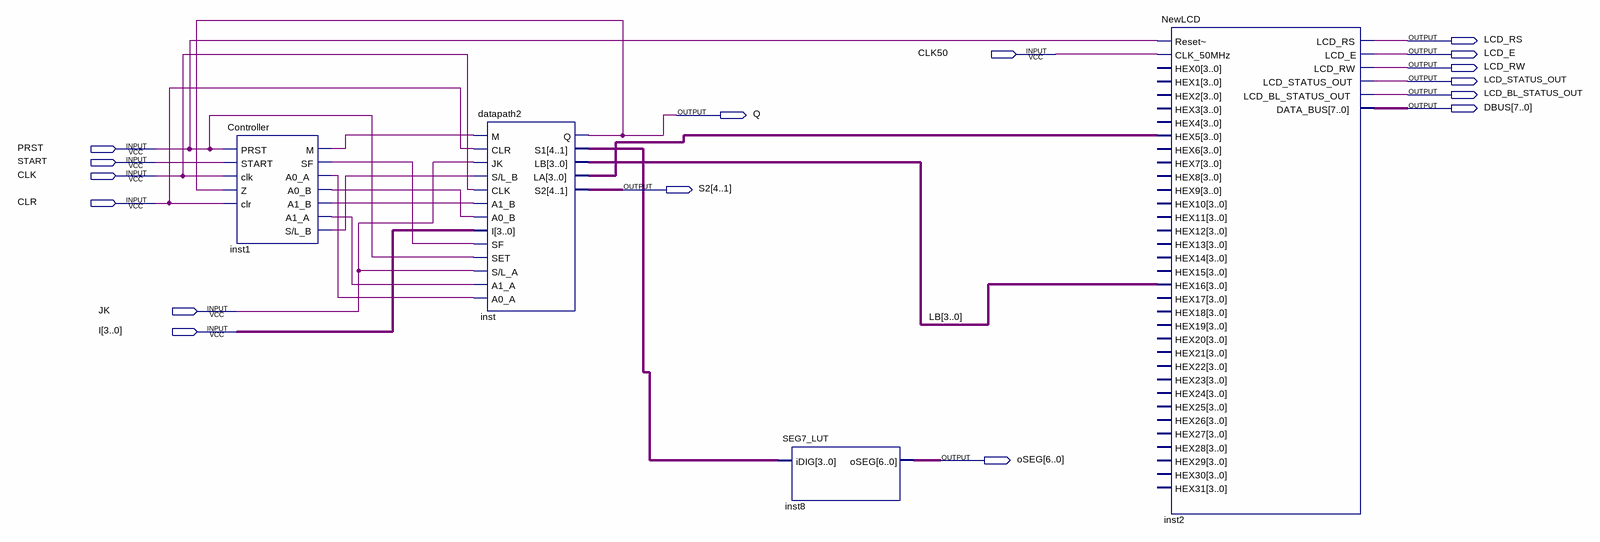
[diagram p0: schematic sheet]
// Quartus schematic last.bdf as structural Verilog: 4 symbols, 16 pins
module last (
  input  CLK50,
  input  PRST,
  input  START,
  input  CLK,
  input  CLR,
  input  JK,
  input  [3:0] I,
  output LCD_RS,
  output LCD_E,
  output LCD_RW,
  output LCD_STATUS_OUT,
  output LCD_BL_STATUS_OUT,
  output [7:0] DBUS,
  output Q,
  output [4:1] S2,
  output [6:0] oSEG
);

  wire inst1_a0_a, inst1_a0_b, inst1_a1_a, inst1_a1_b, inst1_m, inst1_s_l_b, inst1_sf;
  wire [3:0] inst_la, inst_s1, LB;

  Controller inst1 (
    .PRST(PRST), .START(START), .clk(CLK), .Z(Q), .clr(CLR), .M(inst1_m), .SF(inst1_sf), .A0_A(inst1_a0_a),
    .A0_B(inst1_a0_b), .A1_B(inst1_a1_b), .A1_A(inst1_a1_a), .\S/L_B (inst1_s_l_b));
  datapath2 inst (
    .M(inst1_m), .CLR(CLR), .JK(JK), .\S/L_B (inst1_s_l_b), .CLK(CLK), .A1_B(inst1_a1_b), .A0_B(inst1_a0_b),
    .I(I), .SF(inst1_sf), .SET(PRST), .\S/L_A (JK), .A1_A(inst1_a1_a), .A0_A(inst1_a0_a), .Q(Q),
    .S1(inst_s1), .LB(LB), .LA(inst_la), .S2(S2));
  SEG7_LUT inst8 (.iDIG(inst_s1), .oSEG(oSEG));
  NewLCD inst2 (
    .\Reset~ (PRST), .CLK_50MHz(CLK50), .HEX5(inst_la), .HEX16(LB), .LCD_RS(LCD_RS), .LCD_E(LCD_E),
    .LCD_RW(LCD_RW), .LCD_STATUS_OUT(LCD_STATUS_OUT), .LCD_BL_STATUS_OUT(LCD_BL_STATUS_OUT), .DATA_BUS(DBUS));  // open: HEX0, HEX1, HEX2, HEX3, HEX4, HEX6, HEX7, HEX8, HEX9, HEX10, HEX11, HEX12, HEX13, HEX14, HEX15, HEX17, HEX18, HEX19, HEX20, HEX21, HEX22, HEX23, HEX24, HEX25, HEX26, HEX27, HEX28, HEX29, HEX30, HEX31
endmodule
